# Altium schematic sheet MOSFETs.SchDoc
size A4; SheetNumber: 2; SheetTotal: 3
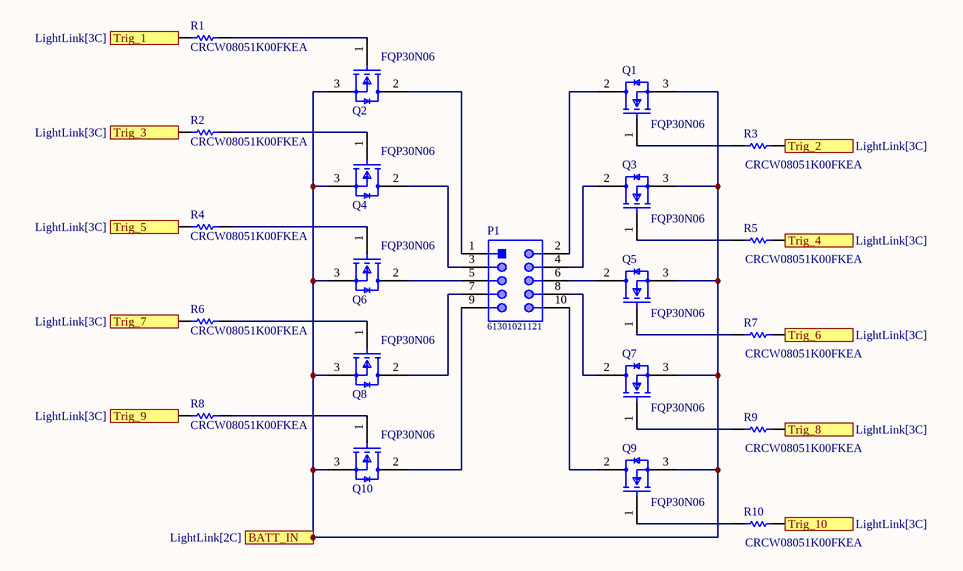
[diagram p0: MOSFETs.SchDoc]

## Parts
P1  61301021121  [61301021121]
Q1  FQP30N06  [FP-340AT-MFG]
Q2  FQP30N06  [FP-340AT-MFG]
Q3  FQP30N06  [FP-340AT-MFG]
Q4  FQP30N06  [FP-340AT-MFG]
Q5  FQP30N06  [FP-340AT-MFG]
Q6  FQP30N06  [FP-340AT-MFG]
Q7  FQP30N06  [FP-340AT-MFG]
Q8  FQP30N06  [FP-340AT-MFG]
Q9  FQP30N06  [FP-340AT-MFG]
Q10  FQP30N06  [FP-340AT-MFG]
R1  CRCW08051K00FKEA  [RESC2013X50X30NL20T20]
R2  CRCW08051K00FKEA  [RESC2013X50X30NL20T20]
R3  CRCW08051K00FKEA  [RESC2013X50X30NL20T20]
R4  CRCW08051K00FKEA  [RESC2013X50X30NL20T20]
R5  CRCW08051K00FKEA  [RESC2013X50X30NL20T20]
R6  CRCW08051K00FKEA  [RESC2013X50X30NL20T20]
R7  CRCW08051K00FKEA  [RESC2013X50X30NL20T20]
R8  CRCW08051K00FKEA  [RESC2013X50X30NL20T20]
R9  CRCW08051K00FKEA  [RESC2013X50X30NL20T20]
R10  CRCW08051K00FKEA  [RESC2013X50X30NL20T20]

## Ports
BATT_IN (in, see LightLink[2C]), Trig_1 (in, see LightLink[3C]), Trig_2 (in, see LightLink[3C]), Trig_3 (in, see LightLink[3C]), Trig_4 (in, see LightLink[3C]), Trig_5 (in, see LightLink[3C]), Trig_6 (in, see LightLink[3C]), Trig_7 (in, see LightLink[3C]), Trig_8 (in, see LightLink[3C]), Trig_9 (in, see LightLink[3C]), Trig_10 (in, see LightLink[3C])

## Nets
BATT_IN: Q1.3(S) Q2.3(S) Q3.3(S) Q4.3(S) Q5.3(S) Q6.3(S) Q7.3(S) Q8.3(S) Q9.3(S) Q10.3(S) ; port BATT_IN
Trig_1: R1.1 ; port Trig_1
Trig_2: R3.2 ; port Trig_2
Trig_3: R2.1 ; port Trig_3
Trig_4: R5.2 ; port Trig_4
Trig_5: R4.1 ; port Trig_5
Trig_6: R7.2 ; port Trig_6
Trig_7: R6.1 ; port Trig_7
Trig_8: R9.2 ; port Trig_8
Trig_9: R8.1 ; port Trig_9
Trig_10: R10.2 ; port Trig_10
NetP1_1: P1.1 Q2.2(D)
NetP1_2: P1.2 Q1.2(D)
NetP1_3: P1.3 Q4.2(D)
NetP1_4: P1.4 Q3.2(D)
NetP1_5: P1.5 Q6.2(D)
NetP1_6: P1.6 Q5.2(D)
NetP1_7: P1.7 Q8.2(D)
NetP1_8: P1.8 Q7.2(D)
NetP1_9: P1.9 Q10.2(D)
NetP1_10: P1.10 Q9.2(D)
NetQ1_1: Q1.1(G) R3.1
NetQ2_1: Q2.1(G) R1.2
NetQ3_1: Q3.1(G) R5.1
NetQ4_1: Q4.1(G) R2.2
NetQ5_1: Q5.1(G) R7.1
NetQ6_1: Q6.1(G) R4.2
NetQ7_1: Q7.1(G) R9.1
NetQ8_1: Q8.1(G) R6.2
NetQ9_1: Q9.1(G) R10.1
NetQ10_1: Q10.1(G) R8.2

## Library data of the parts
P1 = CMP-1502-01084-1: THT Vertical Pin Header WR-PHD, Pitch 2.54 mm, Dual Row, 10 pins; Manufacturer: Wurth Elektronik; Working Voltage: 250VAC; Pitch: 2.54mm; Contact Resistance: 20mOhm; Gender: Male; Rated Current: 3A; Withstanding Voltage: 500VAC; Pin Number: 10; Operating Temperature: -40to105degC; Mounting Technology: THT; Publisher: WurthElektronik; Manufacturer URL: http://www.we-online.de; Part Number: 61301021121; Row Number: Dual; Packaging: Bag; Orientation: Vertical; Package Reference: 61301021121; Datasheet URL: https://katalog.we-online.de/em/datasheet/6130xx21121.pdf
Q1-Q10 = CMP-07173-000001-1: MOSFET N-CH 60V 30A TO-220; Manufacturer: ON Semiconductor; Threshold Vgs Min: 2V; Power Dissipation: 79W; Rthja Max: 62.5°C/W; Gate To Source Voltage: 25V; Pulse Drain Current: 120A; Transconductance: 16S; Gate Charge At Vgs: 19nC @ 10V; Number Of Channels: 1; Standoff Height: 2.7mm; Input Capacitace At Vds: 725pF @ 25V; Max Junction Temp: +175°C; Depletion Mode: False; Reverse Recovery Charge: 65nC; Threshold Vgs Max: 4V; Max Forward Diode Voltage: 1.5V; Turn On Delay Time: 10ns; Reverse Recovery Time: 45ns; Drain To Source Resistance: 0.031Ω; Turn Off Delay Time: 35ns; Continuous Drain Current: 30A; Manufacturer Part Number: FQP30N06; Octopart: https://octopart.com/fqp30n06-on+semiconductor-84328004; Temperature: -55°C to +175°C; Ipc Land Pattern Name: TO-220; Digikey Description: MOSFET N-CH 60V 30A TO-220; Height: 20.4mm; RoHS: TRUE; Mouser Description: MOSFET 60V N-Channel QFET; Device Class L2: Transistors; Automotive: No; Footprint Url: https://www.onsemi.com/pub/Collateral/340AT.PDF; Number Of N Channels: 1; Device Class L1: Discrete Semiconductors; Package: 340AT; Temperature Range High: +175°C; Temperature Range Low: -55°C; ComponentLink2URL: https://www.onsemi.com/pub/Collateral/FQP30N06-D.pdf; Drain To Source Breakdown Voltage: 60V; Category: Trans; ComponentLink2Description: Datasheet; Device Class L3: MOSFETs; Drain To Source Voltage: 60V; Lead Free: Yes
R1-R10 = CMP-1013-00510-2: Manufacturer: Vishay Dale; Part Number: CRCW08051K00FKEA